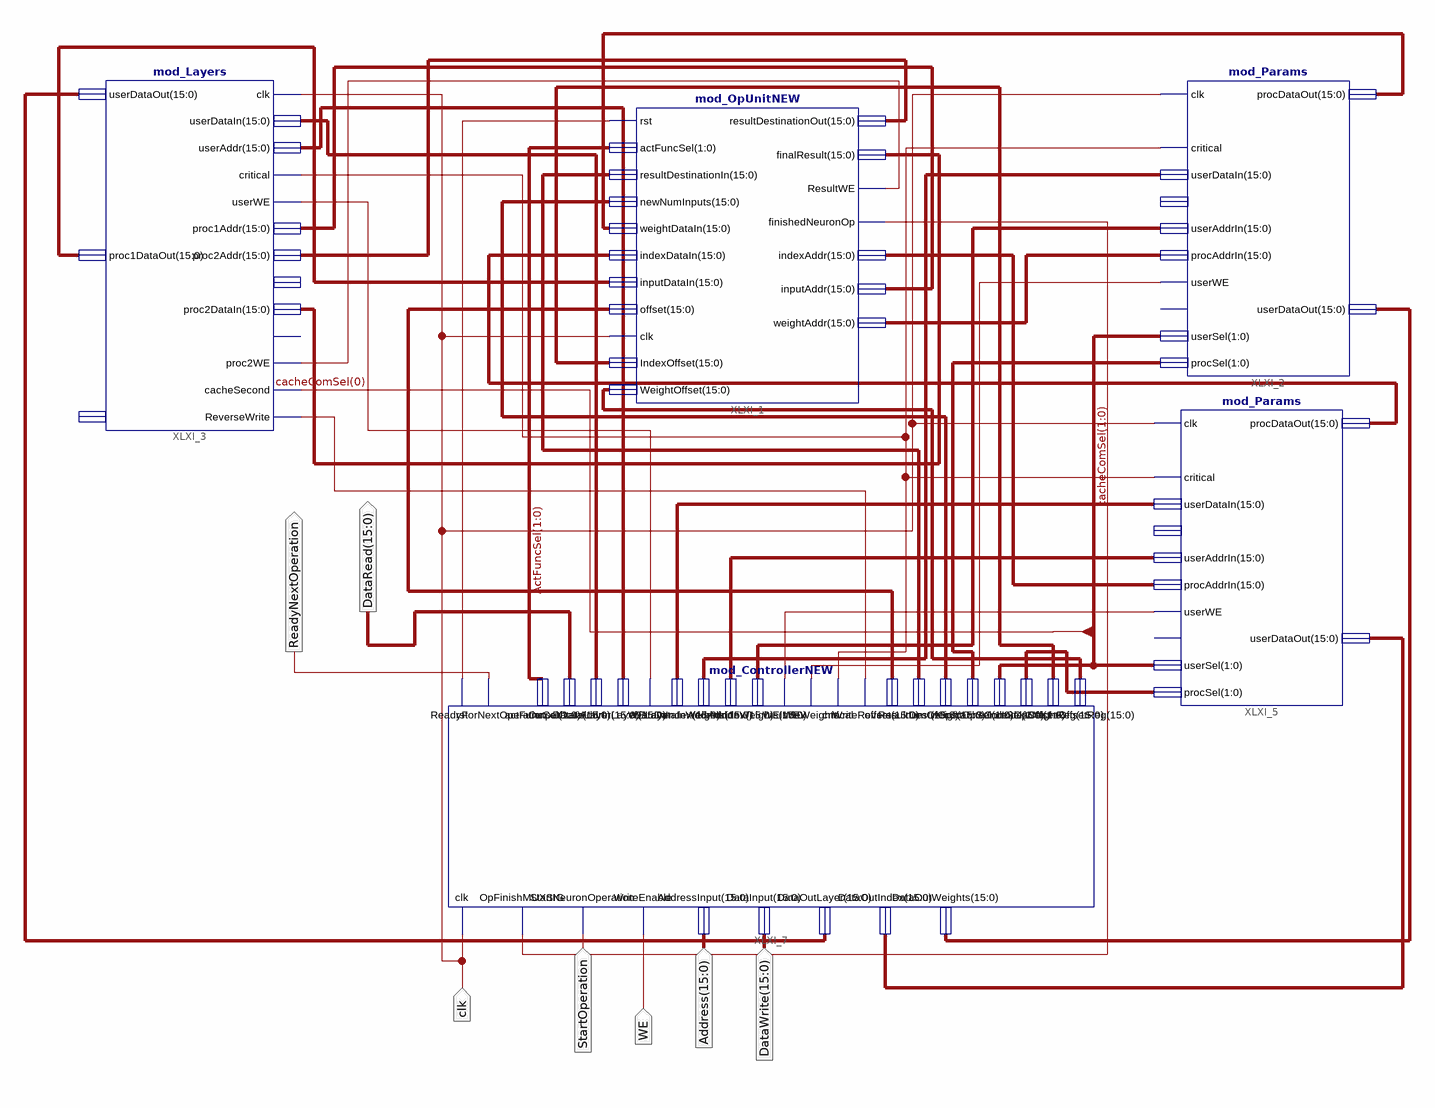
[diagram p0: schematic sheet 1]
// Xilinx ISE schematic NeuroSpider.sch (spartan3e) as structural Verilog: 5 symbols, 7 ports
module NeuroSpider (
  input  clk,
  input  StartOperation,
  input  WE,
  input  [15:0] Address,
  input  [15:0] DataWrite,
  output ReadyNextOperation,
  output [15:0] DataRead
);

  wire XLXN_3, XLXN_5, XLXN_24, XLXN_32, XLXN_33, XLXN_51, XLXN_82, XLXN_93;
  wire [1:0] ActFuncSel, cacheComSel, XLXN_77, XLXN_78;
  wire [15:0] XLXN_6, XLXN_7, XLXN_12, XLXN_13, XLXN_14, XLXN_16, XLXN_20, XLXN_22, XLXN_23, XLXN_27,
       XLXN_29, XLXN_31, XLXN_34, XLXN_60, XLXN_63, XLXN_66, XLXN_71, XLXN_72, XLXN_73, XLXN_83, XLXN_84,
       XLXN_92;

  mod_OpUnitNEW XLXI_1 (
    .rst(XLXN_3), .actFuncSel(ActFuncSel), .resultDestinationIn(XLXN_60), .newNumInputs(XLXN_29),
    .weightDataIn(XLXN_12), .indexDataIn(XLXN_27), .inputDataIn(XLXN_66), .offset(XLXN_63), .clk(clk),
    .IndexOffset(XLXN_84), .WeightOffset(XLXN_83), .resultDestinationOut(XLXN_92), .finalResult(XLXN_31),
    .ResultWE(XLXN_32), .finishedNeuronOp(XLXN_33), .indexAddr(XLXN_23), .inputAddr(XLXN_34),
    .weightAddr(XLXN_16));
  mod_Params XLXI_2 (
    .clk(clk), .critical(XLXN_5), .userDataIn(XLXN_13), .userAddrIn(XLXN_14), .procAddrIn(XLXN_16),
    .userWE(XLXN_93), .procDataOut(XLXN_12), .userDataOut(XLXN_73), .userSel(cacheComSel), .procSel(XLXN_77));  // open: procDataIn, procWE
  mod_Layers XLXI_3 (
    .clk(clk), .userDataIn(XLXN_6), .userAddr(XLXN_7), .critical(XLXN_5), .userWE(XLXN_82),
    .proc1Addr(XLXN_34), .proc2Addr(XLXN_92), .proc2DataIn(XLXN_31), .proc2WE(XLXN_32),
    .cacheSecond(cacheComSel[0]), .ReverseWrite(XLXN_51), .userDataOut(XLXN_71), .proc1DataOut(XLXN_66));  // open: proc1DataIn, proc1WE, proc2DataOut
  mod_Params XLXI_5 (
    .clk(clk), .critical(XLXN_5), .userDataIn(XLXN_20), .userAddrIn(XLXN_22), .procAddrIn(XLXN_23),
    .userWE(XLXN_24), .procDataOut(XLXN_27), .userDataOut(XLXN_72), .userSel(cacheComSel), .procSel(XLXN_78));  // open: procDataIn, procWE
  mod_ControllerNEW XLXI_7 (
    .WriteEnable(WE), .StartNeuronOperation(StartOperation), .AddressInput(Address), .DataInput(DataWrite),
    .DataOutWeights(XLXN_73), .DataOutIndex(XLXN_72), .DataOutLayer(XLXN_71), .OpFinishMUXSIG(XLXN_33),
    .clk(clk), .critical(XLXN_5), .weightOpSel(XLXN_77), .actFuncSel(ActFuncSel), .OutputData(DataRead),
    .WriteReverse(XLXN_51), .offset(XLXN_63), .ResultDest(XLXN_60), .numOfOps(XLXN_29),
    .cacheComSel(cacheComSel), .IndexOpSel(XLXN_78), .WEWeights(XLXN_93), .WEIndex(XLXN_24),
    .AddrInWeights(XLXN_14), .AddrInIndex(XLXN_22), .DataInWeights(XLXN_13), .DataInIndex(XLXN_20),
    .WELayer(XLXN_82), .AddrInLayer(XLXN_7), .DataInLayer(XLXN_6),
    .ReadyForNextOperation(ReadyNextOperation), .rst(XLXN_3), .IndexOffsetReg(XLXN_84),
    .WeightOffsetReg(XLXN_83));
endmodule
